# EAGLE schematic supply (EAGLE 7.5.0)
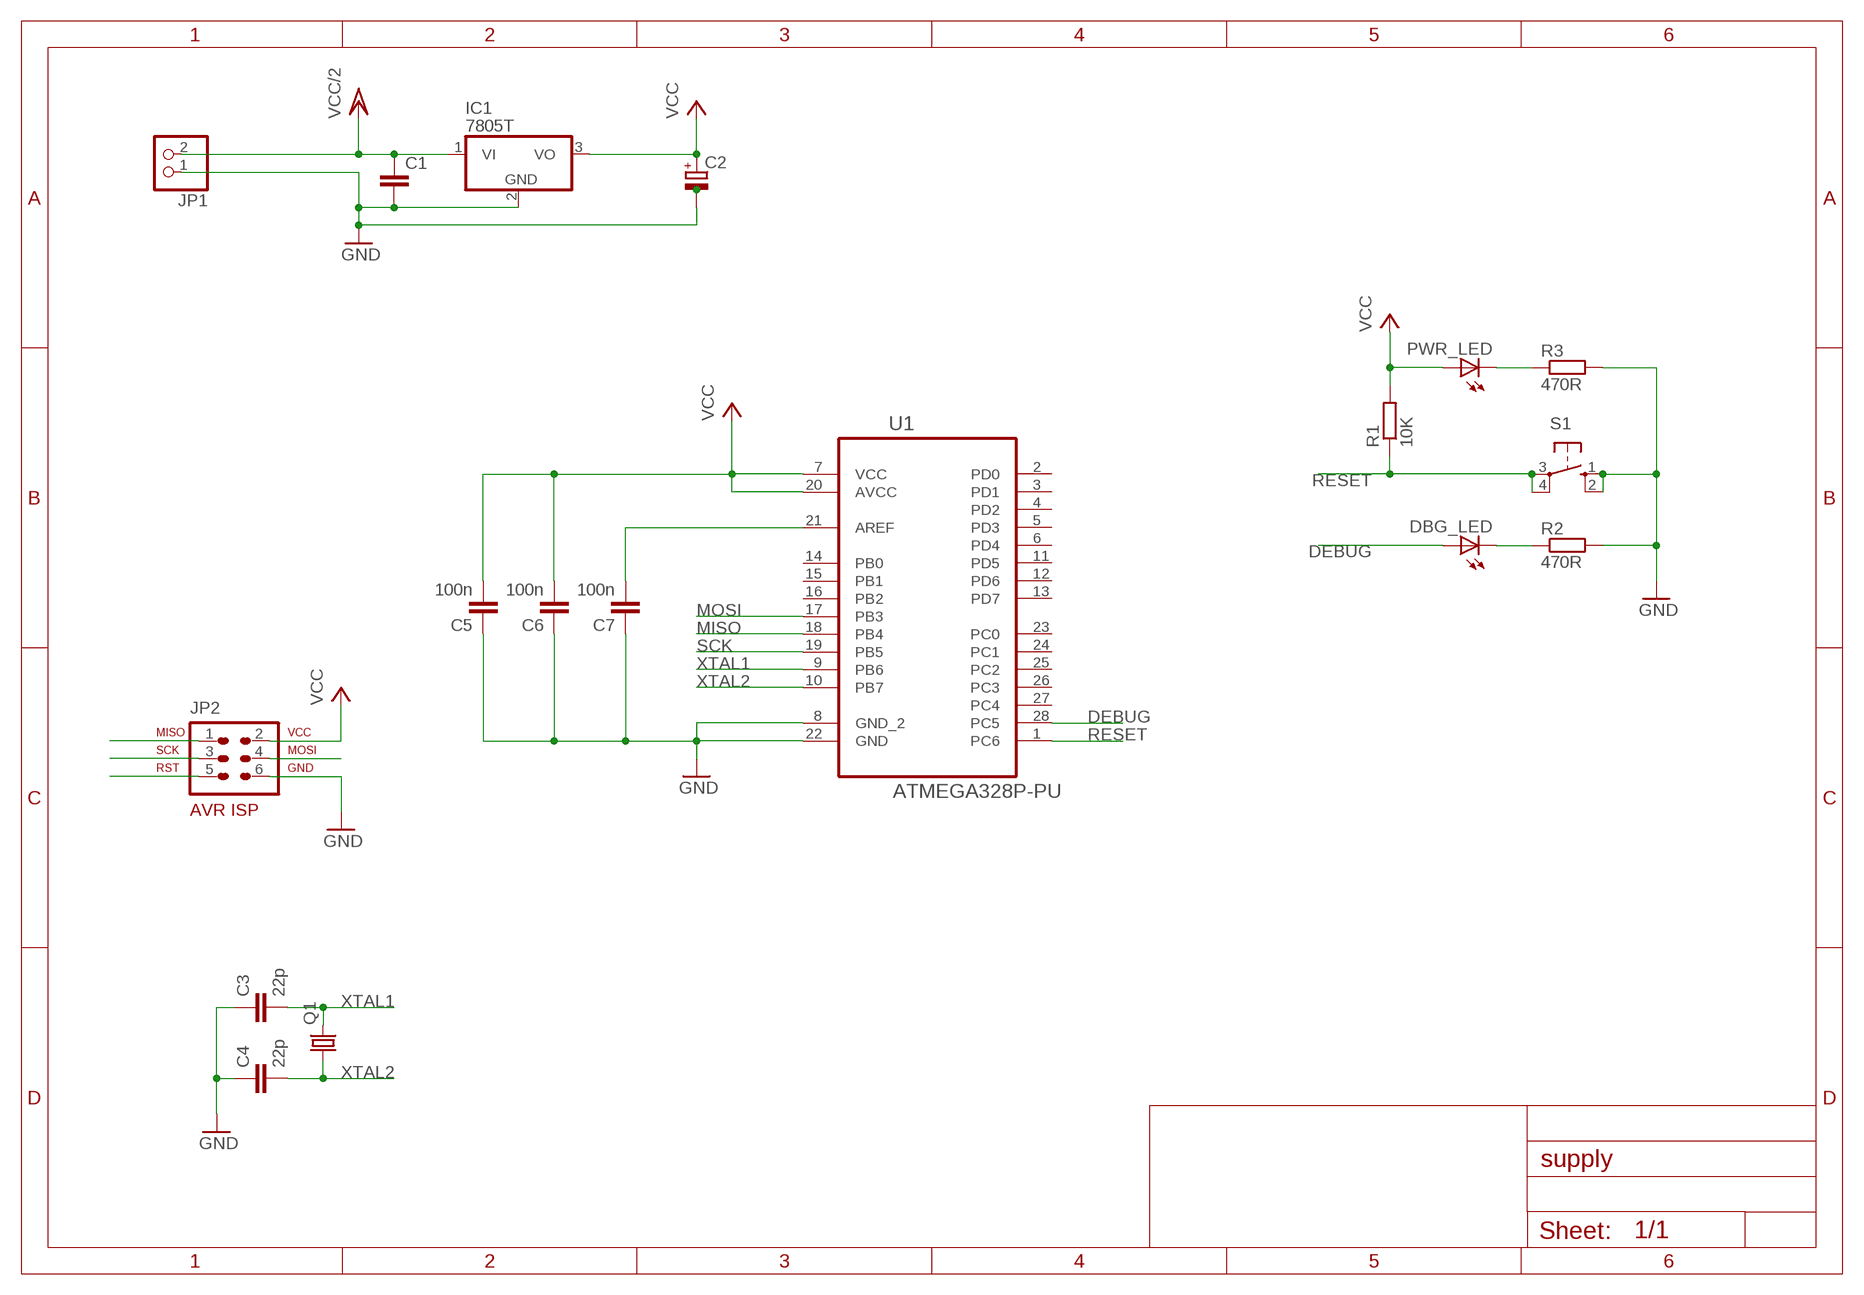
[diagram p0: schematic, sheet 1]

## Parts
C1  C-EUC1206K  [C1206K]
C2  CPOL-EUE2.5-5  [E2,5-5]
C3  22p  C-EUC0805K  [C0805K]
C4  22p  C-EUC0805K  [C0805K]
C5  100n  C-EUC0805K  [C0805K]
C6  100n  C-EUC0805K  [C0805K]
C7  100n  C-EUC0805K  [C0805K]
DBG_LED  LED5MM  [LED5MM]
IC1  7805T  [TO220H]
JP1  PINHD-1X2  [1X02]
JP2  AVR-ISP-6VERT  [AVR-ISP-6]
PWR_LED  LED5MM  [LED5MM]
Q1  CRYSTALHC49S  [HC49/S]
R1  10K  R-EU_M0805  [M0805]
R2  470R  R-EU_M0805  [M0805]
R3  470R  R-EU_M0805  [M0805]
S1  10-XX  [B3F-10XX]
U1  ATMEGA328P-PU  [DIP254P762X457-28]

## Nets
DEBUG: DBG_LED.A U1.28(PC5)
GND: C1.2 C2.- C3.1 C4.1 C5.1 C6.1 C7.1 IC1.2(GND) JP1.1 JP2.6 R2.2 R3.2 S1.1(S) S1.2(S1) U1.8(GND_2) U1.22(GND)
MISO: JP2.1 U1.18(PB4)
MOSI: JP2.4 U1.17(PB3)
N$1: PWR_LED.K(C) R3.1
N$2: DBG_LED.K(C) R2.1
N$3: C7.2 U1.21(AREF)
RESET: JP2.5 R1.1 S1.3(P) S1.4(P1) U1.1(PC6)
SCK: JP2.3 U1.19(PB5)
VCC: C2.+ C5.2 C6.2 IC1.3(VO) JP2.2 PWR_LED.A R1.2 U1.7(VCC) U1.20(AVCC)
VCC/2: C1.1 IC1.1(VI) JP1.2
XTAL1: C3.2 Q1.2 U1.9(PB6)
XTAL2: C4.2 Q1.1 U1.10(PB7)
Unconnected: U1.2(PD0) U1.3(PD1) U1.4(PD2) U1.5(PD3) U1.6(PD4) U1.11(PD5) U1.12(PD6) U1.13(PD7) U1.14(PB0) U1.15(PB1) U1.16(PB2) U1.23(PC0) U1.24(PC1) U1.25(PC2) U1.26(PC3) U1.27(PC4)

## Library data of the parts
C1 C3-C7 = resistor:C-EU: CAPACITOR, European symbol
C2 = resistor:CPOL-EU: POLARIZED CAPACITOR, European symbol
DBG_LED PWR_LED = led:LED: LED OSRAM: - CHIPLED LG R971, LG N971, LY N971, LG Q971, LY Q971, LO R971, LY R971 LH N974, LH R974 LS Q976, LO Q976, LY Q976 LO Q996 - Hyper CHIPLED LW Q18S LB Q993, LB Q99A, LB R99A - SideLED LS A670, LO A670, LY A670, LG A670, LP A670 LB A673, LV A673, LT A673, LW A673 LH A674 LY A675 LS A676, LA A676, LO A676, LY A676, LW A676 LS A679, LY A679, LG A679 - Hyper Micro SIDELED® LS Y876, LA Y876, LO Y876, LY Y876 LT Y87S - SmartLED LW L88C, LW L88S LB L89C, LB L89S, LG L890 LS L89K, LO L89K, LY L89K LS L896, LA L896, LO L896, LY L896 - TOPLED LS T670, LO T670, LY T670, LG T670, LP T670 LSG T670, LSP T670, LSY T670, LOP T670, LYG T670 LG T671, LOG T671, LSG T671 LB T673, LV T673, LT T673, LW T673 LH T674 LS T676, LA T676, LO T676, LY T676, LB T676, LH T676, LSB T676, LW T676 LB T67C, LV T67C, LT T67C, LS T67K, LO T67K, LY T67K, LW E67C LS E67B, LA E67B, LO E67B, LY E67B, LB E67C, LV E67C, LT E67C LW T67C LS T679, LY T679, LG T679 LS T770, LO T770, LY T770, LG T770, LP T770 LB T773, LV T773, LT T773, LW T773 LH T774 LS E675, LA E675, LY E675, LS T675 LS T776, LA T776, LO T776, LY T776, LB T776 LHGB T686 LT T68C, LB T68C - Hyper Mini TOPLED® LB M676 - Mini TOPLED Santana® LG M470 LS M47K, LO M47K, LY M47K Source: http://www.osram.convergy.de LUXEON: - LUMILED® LXK2-PW12-R00, LXK2-PW12-S00, LXK2-PW14-U00, LXK2-PW14-V00 LXK2-PM12-R00, LXK2-PM12-S00, LXK2-PM14-U00 LXK2-PE12-Q00, LXK2-PE12-R00, LXK2-PE12-S00, LXK2-PE14-T00, LXK2-PE14-U00 LXK2-PB12-K00, LXK2-PB12-L00, LXK2-PB12-M00, LXK2-PB14-N00, LXK2-PB14-P00, LXK2-PB14-Q00 LXK2-PR12-L00, LXK2-PR12-M00, LXK2-PR14-Q00, LXK2-PR14-R00 LXK2-PD12-Q00, LXK2-PD12-R00, LXK2-PD12-S00 LXK2-PH12-R00, LXK2-PH12-S00 LXK2-PL12-P00, LXK2-PL12-Q00, LXK2-PL12-R00 Source: www.luxeon.com KINGBRIGHT: KA-3528ASYC Source: www.kingbright.com
IC1 = linear:78*: Positive VOLTAGE REGULATOR Source: http://cache.national.com/ds/LM/LM78L05.pdf http://www.fairchildsemi.com/ds/LM/LM7805.pdf
JP1 = pinhead:PINHD-1X2: PIN HEADER
JP2 = avr-7:AVR-ISP-6: AVR ISP-6 Serial Programming Header
Q1 = crystal:CRYSTAL: CRYSTAL; OC_FARNELL: 1667008; OC_NEWARK: unknown
R1-R3 = resistor:R-EU_: RESISTOR, European symbol
S1 = switch-omron:10-XX: OMRON SWITCH; MPN: B3F-1000; OC_FARNELL: 176432; OC_NEWARK: 36M3542
U1 = untitled:ATMEGA328P-PU: 8-bit Microcontroller with In-System Programmable Flash; MPN: ATMEGA328P-PU; OC_FARNELL: 1715487; OC_NEWARK: 15R0268; PACKAGE: PDIP-28; SUPPLIER: Atmel